# Altium schematic sheet 01_MAIN.SchDoc: =GlobalProjectName
size 410 x 297 mm; CheckedBy: A_D; Author: A_D; SheetNumber: 1; SheetTotal: 3; PageSetup: Record=PageOptions|CenterHorizontal=True|CenterVertical=True|PrintScale=0.70|XCorrection=1.00|YCorrection=1.00|PrintKind=2|BorderSize=5000000|LeftOffset=9000|BottomOffset=10100|Orientation=2|PaperLength=11176|PaperWidth=8636|Scale=100|PaperSource=259|PrintQuality=-3|MediaType=1|DitherType=10|PrintScaleMode=1|PaperKind=A3|PaperIndex=8
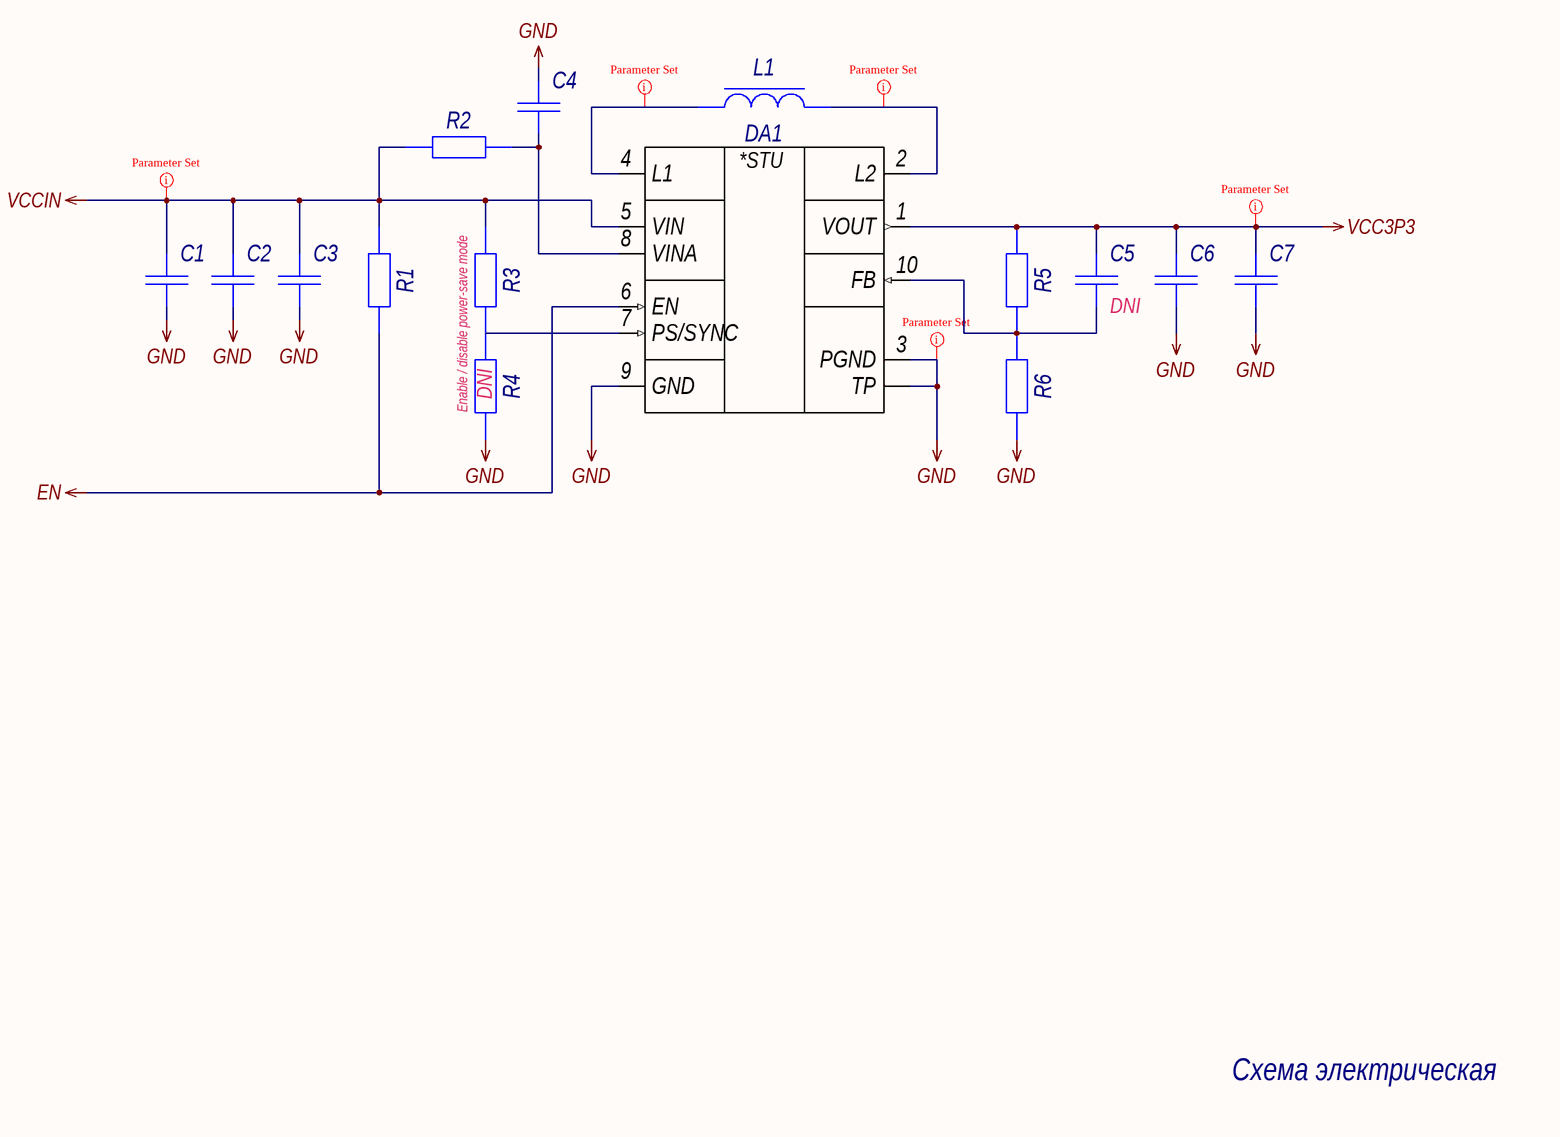
[diagram p0: 01_MAIN.SchDoc]

## Parts
C1  Capacitor  [C0603_L]  (value not drawn)
C2  Capacitor  [C0603_L]  (value not drawn)
C3  Capacitor  [C0603_L]  (value not drawn)
C4  Capacitor  [C0603_L]  (value not drawn)
C5  Capacitor  [C0603_L]  (value not drawn)  (no BOM)
C6  Capacitor  [C0603_L]  (value not drawn)
C7  Capacitor  [C0603_L]  (value not drawn)
DA1  TPS6300x  [VSON-10_050P300X300X100_N]  (value not drawn)
L1  Coil  [LQH43CN-Series]  (value not drawn)
R1  Resistor  [R0603_L]  (value not drawn)
R2  Resistor  [R0603_L]  (value not drawn)
R3  Resistor  [R0603_L]  (value not drawn)
R4  Resistor  [R0603_L]  (value not drawn)  (no BOM)
R5  Resistor  [R0603_L]  (value not drawn)
R6  Resistor  [R0603_L]  (value not drawn)

## Nets
EN: DA1.6(EN) R1.1
GND: C1.1 C2.1 C3.1 C4.2 C6.1 C7.1 DA1.3(PGND) DA1.9(GND) DA1.TP R4.1 R6.1
VCC3P3: C5.2 C6.2 C7.2 DA1.1(VOUT) R5.2
VCCIN: C1.2 C2.2 C3.2 DA1.5(VIN) R1.2 R2.1 R3.2
NetC4_1: C4.1 DA1.8(VINA) R2.2
NetC5_1: C5.1 DA1.10(FB) R5.1 R6.2
NetDA1_2: DA1.2(L2) L1.2
NetDA1_4: DA1.4(L1) L1.1
NetDA1_7: DA1.7(PS/SYNC) R3.1 R4.2

## Layout directives
rule Polygon Connect Style [Style - Direct Connect]: GND, NetDA1_2, NetDA1_4, VCC3P3, VCCIN

## Notes on the sheet
- (near C5) DNI
- Enable / disable power-save mode
- (near R4) DNI
- Схема электрическая
  принципиальная
- Перв. примен.
- Справ. №
- Подп. и дата
- Инв. № дубл.
- Взам. инв. №
- Разраб.
- Изм.
- Лист
- № докум.
- Подп.
- Дата
- Литера
- Масса
- Масштаб
- Пров.
- Т.контр.
- Листов
- Инв. № подл.
- Н.контр.
- Утв.
- Форма 1 ГОСТ 2.104-2006
- Копировал
- Формат А3
- (in symbol TPS63000DRCR) *STU

## Library data of the parts
C1 C2 C6 C7 = GRM188R61E106MA73D: Manufacturer: Murata; Type: Конденсатор; ID: 165; Value: 10uF; Voltage: 25V; Tolerance: ±20%; Dielectric Type: X5R; Application Category: 1; Working Temperature Min: -55°С; Working Temperature Max: +85°С; Published: 18.05.2010; Publisher: Andrew Danich; Part Number: GRM188R61E106MA73D; Footprint: 0603
C3 C4 = GRM188R72A104KA35D: Manufacturer: Murata; Type: Конденсатор; ID: 232; Value: 0.1uF; Voltage: 100V; Tolerance: ±10%; Dielectric Type: X7R; Application Category: 1; Working Temperature Min: -55°С; Working Temperature Max: +125°С; Published: 18.05.2010; Publisher: Andrew Danich; Part Number: GRM188R72A104KA35D; Footprint: 0603
C5 = GCM1885C2A101JA16D: Manufacturer: Murata; Type: Конденсатор; ID: 155; Value: 100pF; Voltage: 100V; Tolerance: ±5%; Dielectric Type: NP0; Application Category: 1; Working Temperature Min: -55°С; Working Temperature Max: +125°С; Published: 18.05.2010; Publisher: Andrew Danich; Part Number: GCM1885C2A101JA16D; Footprint: 0603
DA1 = TPS63000DRCR: Manufacturer: Texas Instruments; ID: 25; Input Voltage: +1.8…5.5V; Output Current: 800mA\1.2A; Output Voltage: +1.2…5.5V; Efficiency: 96%; Shutdown Input: YES; Frequency: 1.2MHz; Application Category: 1; Working Temperature Min: -40°С; Working Temperature Max: +85°С; Functional Analog: TPS63000DRCT; Type: Микросхема; Published: 23.08.2017; Publisher: Andrew Danich; Part Number: TPS63000DRCR; Value: TPS63000DRCR
L1 = LQH43CN2R2M03L: Manufacturer: Murata Electronics; Type: Дроссель; ID: 97; Rated Current: 900mA; Tolerance: ±20%; Inductance: 2.2uH; DC Resistance: 0.11ohm; Self-Resonant Frequency: 60MHz; Application Category: 1; Working Temperature Min: -25°С; Working Temperature Max: +85°С; Published: 20.05.2010; Publisher: Andrew Danich; Part Number: LQH43CN2R2M03L; Value: LQH43CN2R2M03L; Footprint: LQH43CN
R1 R3 R4 = RC0603JR-070R: Manufacturer: Yageo; ID: 5; Value: 0; Limit Voltage: 50V; Tolerance: ±5%; Temperature Coefficient: 100ppm; Total Power Dissipation: 0.1W; Series Type: Thick-Film; Application Category: 1; Working Temperature Min: -55°С; Working Temperature Max: +155°С; Functional Analog: RC0603FR-070RL, CR0603-J/-000E; Published: 24.03.2010; Publisher: Andrew Danich; Type: Резистор; Part Number: RC0603JR-070R; Footprint: 0603
R2 = RC0603JR-07100R: Manufacturer: Yageo; ID: 10; Value: 100; Limit Voltage: 50V; Tolerance: ±5%; Temperature Coefficient: 100ppm; Total Power Dissipation: 0.1W; Series Type: Thick-Film; Application Category: 1; Working Temperature Min: -55°С; Working Temperature Max: +155°С; Functional Analog: CR0603-JW-101E; Published: 24.03.2010; Publisher: Andrew Danich; Type: Резистор; Part Number: RC0603JR-07100R; Footprint: 0603
R5 = RC0603JR-071ML: Manufacturer: Yageo; ID: 20; Value: 1meg; Limit Voltage: 50V; Tolerance: ±5%; Temperature Coefficient: 100ppm; Total Power Dissipation: 0.1W; Series Type: Thick-Film; Application Category: 1; Working Temperature Min: -55°С; Working Temperature Max: +155°С; Published: 24.03.2010; Publisher: Andrew Danich; Type: Резистор; Part Number: RC0603JR-071ML; Footprint: 0603
R6 = RC0603JR-07180KL: Manufacturer: Yageo; ID: 17; Value: 180k; Limit Voltage: 50V; Tolerance: ±5%; Temperature Coefficient: 100ppm; Total Power Dissipation: 0.1W; Series Type: Thick-Film; Application Category: 1; Working Temperature Min: -55°С; Working Temperature Max: +155°С; Published: 24.03.2010; Publisher: Andrew Danich; Type: Резистор; Part Number: RC0603JR-07180KL; Footprint: 0603